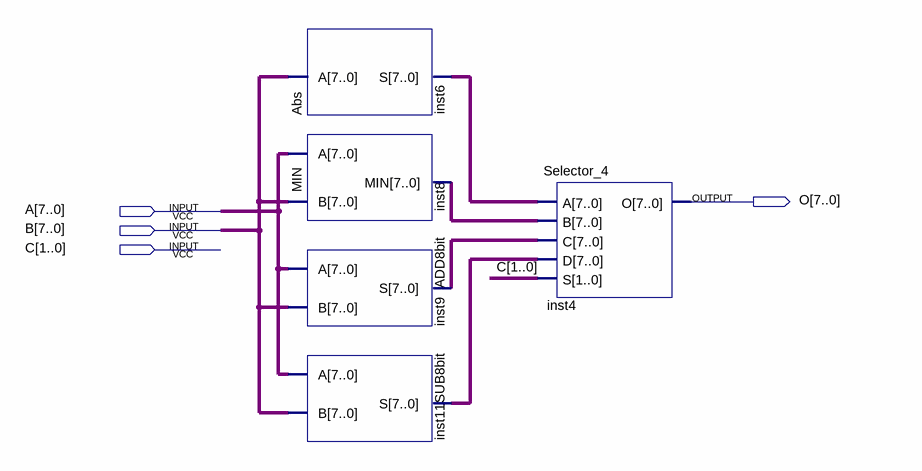
[diagram p0: schematic sheet]
// Quartus schematic ABS_MIN.bdf as structural Verilog: 5 symbols, 4 pins
module ABS_MIN (
  input  [7:0] A,
  input  [7:0] B,
  input  [1:0] C,
  output [7:0] O
);

  wire [7:0] inst6_s, inst8_min, inst9_s, inst11_s;

  Abs inst6 (.A(B), .S(inst6_s));
  MIN inst8 (.A(A), .B(B), .MIN(inst8_min));
  ADD8bit inst9 (.A(A), .B(B), .S(inst9_s));
  SUB8bit inst11 (.A(A), .B(B), .S(inst11_s));
  Selector_4 inst4 (.A(inst6_s), .B(inst8_min), .C(inst9_s), .D(inst11_s), .S(C), .O(O));
endmodule
